# EAGLE design Schaltplan (EAGLE 8.2.1)
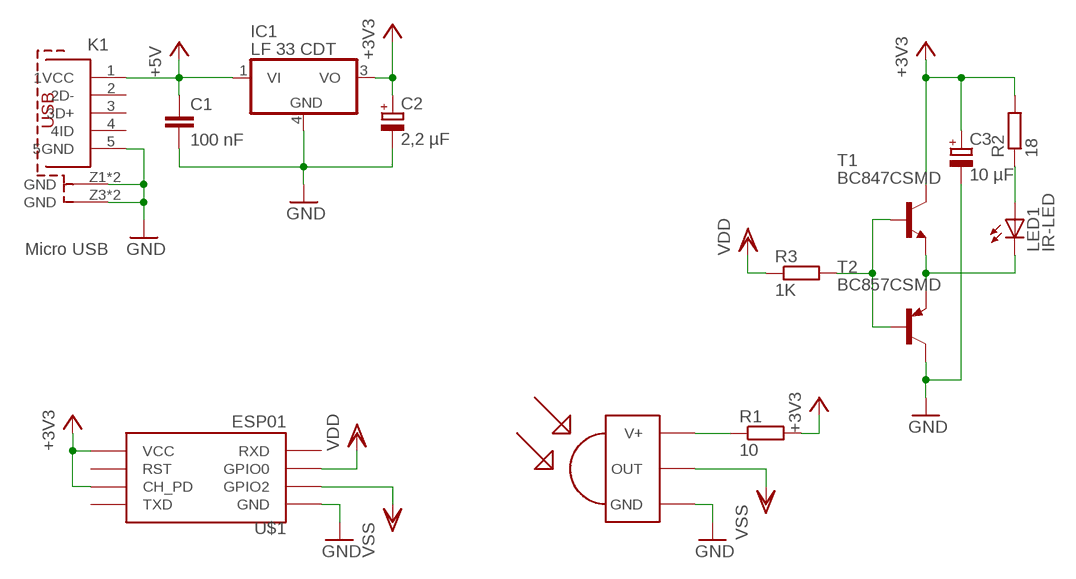
[diagram p0: schematic, sheet 1]

## Parts
C1  100 nF  C-EUC0805K  [C0805K]
C2  2,2 µF  CPOL-EUE2.5-5  [E2,5-5]
C3  10 µF  CPOL-EUE2.5-5  [E2,5-5]
IC1  LF 33 CDT  MC78M05ABDT  [DPACK_3]
IR-TRANSMITTER  TSOP1833  [TSOP18XX]
K1  Micro USB  629105150521  [629105150521]
LED1  IR-LED  LED5MM  [LED5MM]
R1  10  R-EU_M0805  [M0805]
R2  18  R-EU_M0805  [M0805]
R3  1K  R-EU_M0805  [M0805]
T1  BC847CSMD  [SOT23]
T2  BC857CSMD  [SOT23-BEC]
U$1  ESP01  [ESP01]

## Nets
+3V3: C2.+ C3.+ IC1.3(VO) R1.2 R2.2 T1.3(C) U$1.CH_PD U$1.VCC
+5V: C1.1 IC1.1(VI) K1.1(1VCC)
GND: C1.2 C2.- C3.- IC1.4(GND) IR-TRANSMITTER.GND K1.5(5GND) K1.Z1(GND) K1.Z2(GND) K1.Z3(GND) K1.Z4(GND) T2.C U$1.GND
N$1: IR-TRANSMITTER.VCC(V+) R1.1
N$2: R3.2 T1.1(B) T2.B
N$8: LED1.K(C) T1.2(E) T2.E
N$10: LED1.A R2.1
VDD: R3.1 U$1.GPIO0
VSS: IR-TRANSMITTER.OUT U$1.GPIO2
Unconnected: K1.2(2D-) K1.3(3D+) K1.4(4ID) U$1.RST U$1.RX(RXD) U$1.TX(TXD)

## Library data of the parts
C1 = rcl:C-EU: CAPACITOR, European symbol
C2 C3 = rcl:CPOL-EU: POLARIZED CAPACITOR, European symbol
IC1 = linear:MC78M: 500 mA Positive Voltage Regulators Source: Data sheet <http://www.onsemi.com/pub_link/Collateral/MC78M00-D.PDF>
IR-TRANSMITTER = tsop:TSOP1833: IR Receiver and Demodulator
K1 = Wurth_Elektronik_Electromechanic_Input-Output_Connectors_rev15c:629105150521: WR-COM_USB_Micro Type B_Horizontal_SMT ; Micro Type B Horizontal SMT - 3A current at Pin1 & Pin 5 - with Pegs and THT shielding Pins - T&R Packaging Code : Con_I-O_COM_USB_2.0_B_629105150521_629105150521 <http://katalog.we-online.de/media/images/eican/Con_I-O_COM_USB_2.0_B_629105150521_pf2.jpg> Details see: http://katalog.we-online.de/em/datasheet/629105150521.pdf Created 12/08/2014, Dan Xu 2014 (C) Wurth Elektronik
LED1 = led:LED: LED OSRAM: - CHIPLED LG R971, LG N971, LY N971, LG Q971, LY Q971, LO R971, LY R971 LH N974, LH R974 LS Q976, LO Q976, LY Q976 LO Q996 - Hyper CHIPLED LW Q18S LB Q993, LB Q99A, LB R99A - SideLED LS A670, LO A670, LY A670, LG A670, LP A670 LB A673, LV A673, LT A673, LW A673 LH A674 LY A675 LS A676, LA A676, LO A676, LY A676, LW A676 LS A679, LY A679, LG A679 - Hyper Micro SIDELED® LS Y876, LA Y876, LO Y876, LY Y876 LT Y87S - SmartLED LW L88C, LW L88S LB L89C, LB L89S, LG L890 LS L89K, LO L89K, LY L89K LS L896, LA L896, LO L896, LY L896 - TOPLED LS T670, LO T670, LY T670, LG T670, LP T670 LSG T670, LSP T670, LSY T670, LOP T670, LYG T670 LG T671, LOG T671, LSG T671 LB T673, LV T673, LT T673, LW T673 LH T674 LS T676, LA T676, LO T676, LY T676, LB T676, LH T676, LSB T676, LW T676 LB T67C, LV T67C, LT T67C, LS T67K, LO T67K, LY T67K, LW E67C LS E67B, LA E67B, LO E67B, LY E67B, LB E67C, LV E67C, LT E67C LW T67C LS T679, LY T679, LG T679 LS T770, LO T770, LY T770, LG T770, LP T770 LB T773, LV T773, LT T773, LW T773 LH T774 LS E675, LA E675, LY E675, LS T675 LS T776, LA T776, LO T776, LY T776, LB T776 LHGB T686 LT T68C, LB T68C - Hyper Mini TOPLED® LB M676 - Mini TOPLED Santana® LG M470 LS M47K, LO M47K, LY M47K Source: http://www.osram.convergy.de LUXEON: - LUMILED® LXK2-PW12-R00, LXK2-PW12-S00, LXK2-PW14-U00, LXK2-PW14-V00 LXK2-PM12-R00, LXK2-PM12-S00, LXK2-PM14-U00 LXK2-PE12-Q00, LXK2-PE12-R00, LXK2-PE12-S00, LXK2-PE14-T00, LXK2-PE14-U00 LXK2-PB12-K00, LXK2-PB12-L00, LXK2-PB12-M00, LXK2-PB14-N00, LXK2-PB14-P00, LXK2-PB14-Q00 LXK2-PR12-L00, LXK2-PR12-M00, LXK2-PR14-Q00, LXK2-PR14-R00 LXK2-PD12-Q00, LXK2-PD12-R00, LXK2-PD12-S00 LXK2-PH12-R00, LXK2-PH12-S00 LXK2-PL12-P00, LXK2-PL12-Q00, LXK2-PL12-R00 Source: www.luxeon.com KINGBRIGHT: KA-3528ASYC Source: www.kingbright.com
R1-R3 = resistor:R-EU_: RESISTOR, European symbol
T1 = transistor-npn:BC847*: NPN Transistor
T2 = transistor-pnp:BC857*: PNP Transistror
U$1 = esp8266modules:ESP01: ESP8266 Wifi module 01

## Board
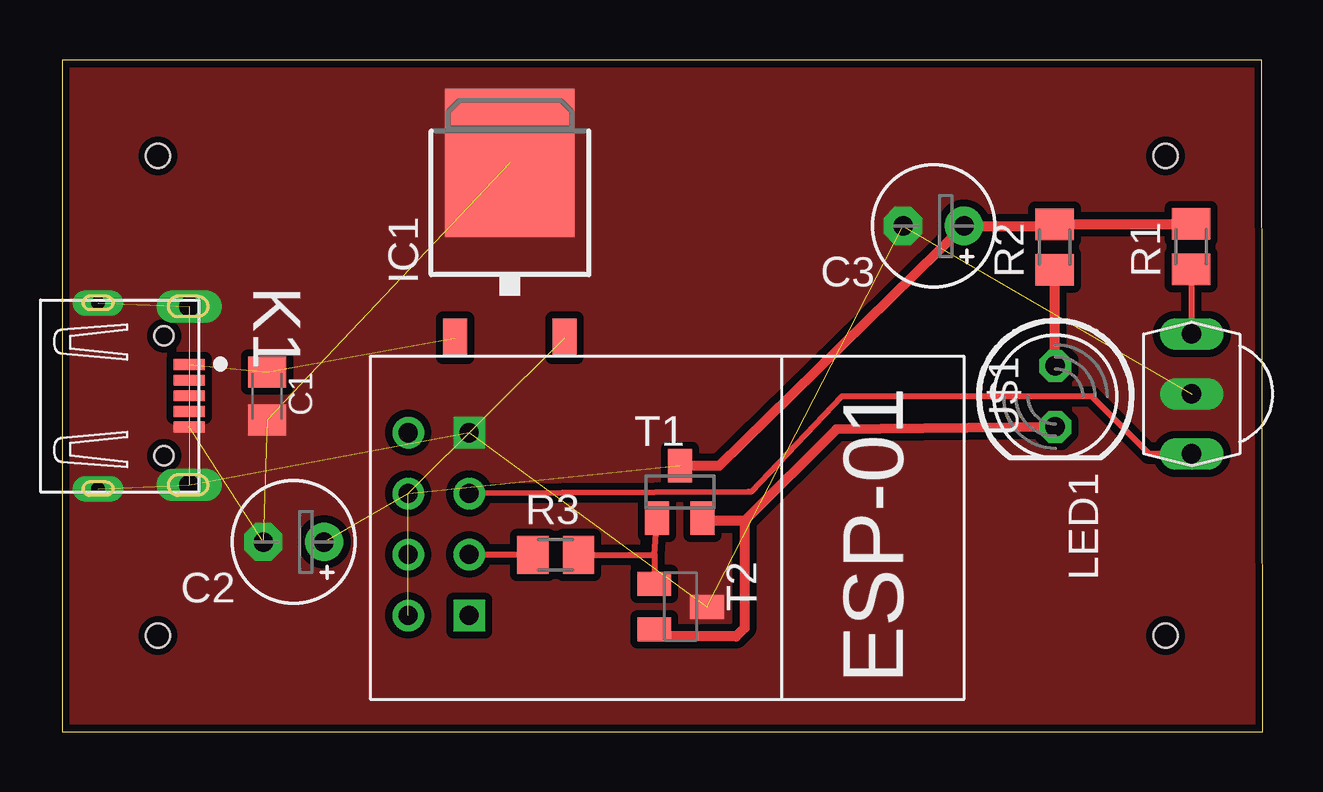
[diagram p1: board, top side]
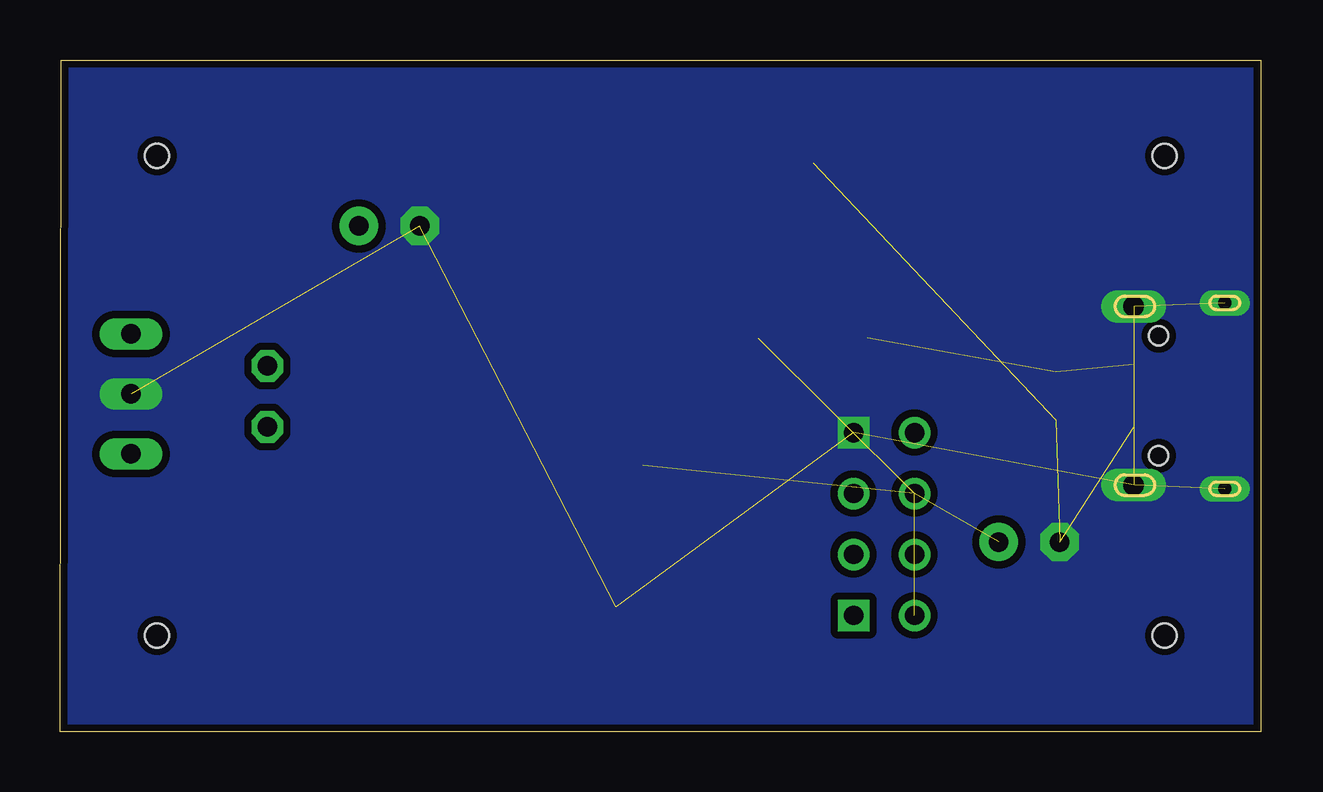
[diagram p2: board, bottom side, seen from below]

Size 50.05 x 28 mm. Coordinates in mm from the lower left corner, seen from the top.
Outline: 0,0 50.05,0 50,28 0,28 0,0
Copper layers (1*16): Top 0.035mm / dielectric 1.5mm / Bottom 0.035mm
Design rules "default *": minimum track width 6mil, minimum drill 0.35mm, track to track 6mil, track to pad 6mil, pad to pad 6mil, via to via 6mil, smd to smd 6mil, copper to edge 10mil, drill to drill 6mil, minimum pad ring 10mil, minimum via ring 8mil, stop-mask expansion 4mil, vias tented up to drill 0mil, thermal gap 10mil
Holes 1 mm at 4,4 4,24 46,4 46,24

### Footprints (pad centres in the part's own frame; a part is rotated, then mirrored left to right if it is on the bottom)
C0805K = smd 1.3 x 1.6: 1 -1,0; 2 1,0
E2,5-5 = drill 0.813 pad 1.6: + -1.27,0 | drill 0.813 pad 1.6 octagon: - 1.27,0
DPACK_3 = smd 1 x 1.6: 1 -2.28,-4.8; 3 2.28,-4.8 | smd 5.4 x 6.2: 4 0,2.5
TSOP18XX = drill 0.813 long: GND -0.001,-0.027; OUT -2.501,-0.027; VCC 2.499,-0.027
629105150521 = smd 0.45 x 1.3: 1 -1.3,3.8; 2 -0.65,3.8; 3 0,3.8; 4 0.65,3.8; 5 1.3,3.8 | drill 0.85 pad 1.2 long: Z1 -3.725,3.8; Z2 3.725,3.8 | drill 0.55 pad 0.9 long: Z3 3.875,0; Z4 -3.875,0 | hole 0.8: -2.5,2.75; 2.5,2.75
LED5MM = drill 0.813 octagon: A -1.27,0; K 1.27,0
M0805 = smd 1.3 x 1.6: 1 -0.95,0; 2 0.95,0
SOT23 = smd 1 x 1.4: 1 -0.95,-1.1; 2 0.95,-1.1; 3 0,1.1
SOT23-BEC = smd 1 x 1.4: B -0.95,-1.1; C 0,1.1; E 0.95,-1.1
ESP01 = drill 0.8: CH_PD -1.285,-8.178; GPIO0 1.255,-5.638; GPIO2 -1.285,-5.638; RST 1.255,-8.178; TX -3.825,-8.178; VCC 3.795,-8.178 | drill 0.8 square: GND -3.825,-5.638; RX 3.795,-5.638

### Placement (x,y rotation side)
C1  8.55,13.99 270 top
C2  9.65,7.91 180 top
C3  36.32,21.08 180 top
IC1  18.67,21.21 0 top
IR-TRANSMITTER  47.06,14.08 90 top
K1  1.5,14 270 top
LED1  41.4,13.97 270 top
R1  47.06,20.22 90 top
R2  41.36,20.2 90 top
R3  20.57,7.37 0 top
T1  25.75,9.99 0 top
T2  25.78,5.21 270 top
U$1  22.61,8.64 270 top

### Tracks (layer width: path | path; a pad name or v marks a point on that pad's centre or on a via)
+3V3  (4 unrouted)
  Top 0.254: 41.5,21.08 R2.2 | 47.14,21.15 R1.2
  Top 0.406: 41.5,21.08 C3.+ 27.4,11.09 T1.3 | R2.2 47.14,21.15
+5V  (2 unrouted)
GND  (11 unrouted)
  pour Top (isolate 0.305, no thermals): 0,0 50,0 50,28 0,28
  pour Bottom (isolate 0.305, no thermals): 0,0 50,0 50,28 0,28
N$1
  Top 0.254: R1.1 47.06,16.6 IR-TRANSMITTER.VCC
N$2
  Top 0.254: 24.7,7.37 T1.1 | 24.7,7.37 24.7,6.18 T2.B | R3.2 24.7,7.37
N$8
  Top 0.254: 26.69,8.77 T1.2 | 24.77,3.96 T2.E
  Top 0.406: LED1.K 32.27,12.6 28.45,8.77 | 28.45,8.77 26.69,8.77 | 28.45,8.77 28.45,4.32 28.09,3.96 24.77,3.96
N$10
  Top 0.254: 41.36,15.3 LED1.A
  Top 0.406: R2.1 41.36,15.3
VDD
  Top 0.254: U$1.GPIO0 19.61,7.38 R3.1
VSS
  Top 0.254: IR-TRANSMITTER.OUT 45.32,11.58 42.93,13.97 32.51,13.97 28.73,9.99 28.6,9.99 U$1.GPIO2